# Altium schematic sheet SWITCHES.SchDoc
size A
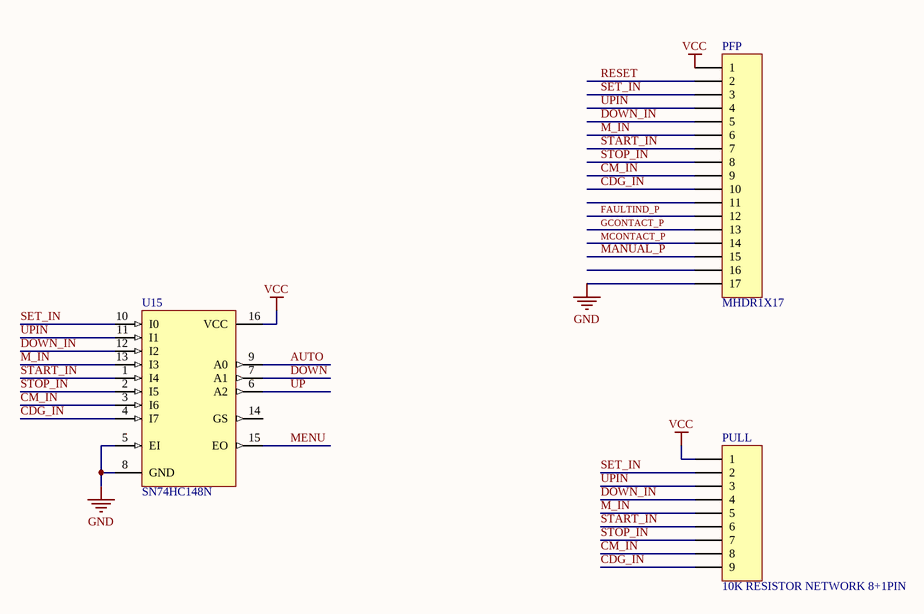
[diagram p0: SWITCHES.SchDoc]

## Parts
PFP  MHDR1X17  [HDR1X17_BURGE_F]
PULL  10K RESISTOR NETWORK 8+1PIN  [RESPACK8+1]
U15  SN74HC148N  [N016D]

## Nets
GND: PFP.17 U15.5(EI) U15.8(GND)
VCC: PFP.1 PULL.1 U15.16(VCC)
AUTO: U15.9(A0)
CDG_IN: PFP.10 PULL.9 U15.4(I7)
CM_IN: PFP.9 PULL.8 U15.3(I6)
DOWN: U15.7(A1)
DOWN_IN: PFP.5 PULL.4 U15.12(I2)
FAULTIND_P: PFP.12
GCONTACT_P: PFP.13
M_IN: PFP.6 PULL.5 U15.13(I3)
MANUAL_P: PFP.15
MCONTACT_P: PFP.14
MENU: U15.15(EO)
RESET: PFP.2
SET_IN: PFP.3 PULL.2 U15.10(I0)
START_IN: PFP.7 PULL.6 U15.1(I4)
STOP_IN: PFP.8 PULL.7 U15.2(I5)
UP: U15.6(A2)
UPIN: PFP.4 PULL.3 U15.11(I1)

Not connected (* = marked no-connect by the designer): PFP 11 16; U15 14(GS)

## Library data of the parts
PFP = MHDR1X17: Header, 17-Pin; LatestRevisionDate: 17-Jul-2002; LatestRevisionNote: Re-released for DXP Platform.; Publisher: Altium Limited
PULL = Header 9: Header, 9-Pin; LatestRevisionDate: 17-Jul-2002; LatestRevisionNote: Re-released for DXP Platform.; Publisher: Altium Limited
U15 = SN74HC148N: 8-Line to 3-Line Priority Encoder; Published: 8-Jun-2000; LatestRevisionDate: 04-Mar-2005; LatestRevisionNote: Stylized 3D Model Added.; DatasheetVersion: Jun-1989; PackageVersion: Oct-1995; PackageReference: N016D; Publisher: Altium Limited; PackageDescription: DIP; 16 Leads; Row Spacing 7.62 mm; Pitch 2.54 mm; Code_JEDEC: MS-001-BB; ComponentLink1Description: Manufacturer Link; ComponentLink1URL: http://www.ti.com/; ComponentLink2Description: Datasheet; ComponentLink2URL: http://www-s.ti.com/sc/ds/sn74hc148.pdf